# Altium schematic sheet power_amplifier.SchDoc
size A4
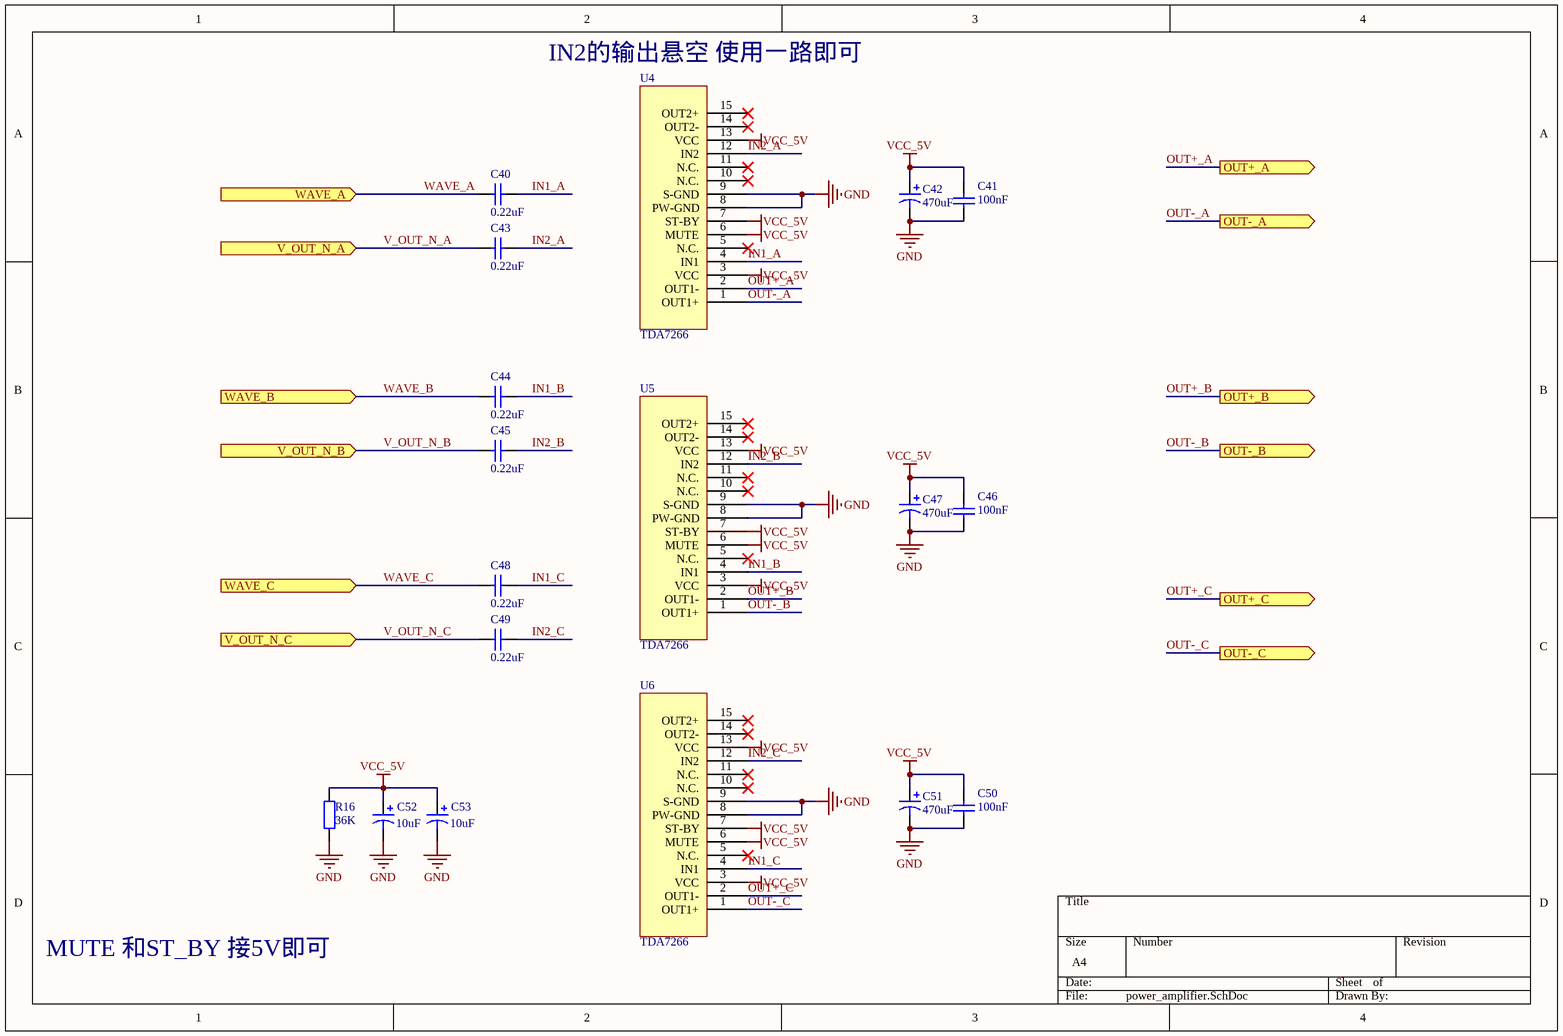
[diagram p0: power_amplifier.SchDoc]

## Parts
C40  value 0.22uF  [0805]  (hidden comment: Cap)
C41  value 100nF  [0805]  (hidden comment: Cap)
C42  value 470uF  [cap贴片铝电解质470uF 16V]  (hidden comment: Cap Poll)
C43  value 0.22uF  [0805]  (hidden comment: Cap)
C44  value 0.22uF  [0805]  (hidden comment: Cap)
C45  value 0.22uF  [0805]  (hidden comment: Cap)
C46  value 100nF  [0805]  (hidden comment: Cap)
C47  value 470uF  [cap贴片铝电解质470uF 16V]  (hidden comment: Cap Poll)
C48  value 0.22uF  [0805]  (hidden comment: Cap)
C49  value 0.22uF  [0805]  (hidden comment: Cap)
C50  value 100nF  [0805]  (hidden comment: Cap)
C51  value 470uF  [cap贴片铝电解质470uF 16V]  (hidden comment: Cap Poll)
C52  value 10uF  [Cap 3528B]  (hidden comment: Cap Poll)
C53  value 10uF  [Cap 3528B]  (hidden comment: Cap Poll)
R16  value 36K  [0805]  (hidden comment: Res)
U4  TDA7266  [TDA7266]
U5  TDA7266  [TDA7266]
U6  TDA7266  [TDA7266]

## Ports
OUT+_A (out), OUT+_B (out), OUT+_C (out), OUT-_A (out), OUT-_B (out), OUT-_C (out), V_OUT_N_A (in), V_OUT_N_B (in), V_OUT_N_C (in), WAVE_A (in), WAVE_B (in), WAVE_C (in)

## Nets
GND: C41.1 C42.2 C46.1 C47.2 C50.1 C51.2 C52.2 C53.2 R16.1 U4.8(PW-GND) U4.9(S-GND) U5.8(PW-GND) U5.9(S-GND) U6.8(PW-GND) U6.9(S-GND)
VCC_5V: C41.2 C42.1 C46.2 C47.1 C50.2 C51.1 C52.1 C53.1 R16.2 U4.3(VCC) U4.6(MUTE) U4.7(ST-BY) U4.13(VCC) U5.3(VCC) U5.6(MUTE) U5.7(ST-BY) U5.13(VCC) U6.3(VCC) U6.6(MUTE) U6.7(ST-BY) U6.13(VCC)
IN1_A: C40.2 U4.4(IN1)
IN1_B: C44.2 U5.4(IN1)
IN1_C: C48.2 U6.4(IN1)
IN2_A: C43.2 U4.12(IN2)
IN2_B: C45.2 U5.12(IN2)
IN2_C: C49.2 U6.12(IN2)
OUT+_A: U4.2(OUT1-) ; port OUT+_A
OUT+_B: U5.2(OUT1-) ; port OUT+_B
OUT+_C: U6.2(OUT1-) ; port OUT+_C
OUT-_A: U4.1(OUT1+) ; port OUT-_A
OUT-_B: U5.1(OUT1+) ; port OUT-_B
OUT-_C: U6.1(OUT1+) ; port OUT-_C
V_OUT_N_A: C43.1 ; port V_OUT_N_A
V_OUT_N_B: C45.1 ; port V_OUT_N_B
V_OUT_N_C: C49.1 ; port V_OUT_N_C
WAVE_A: C40.1 ; port WAVE_A
WAVE_B: C44.1 ; port WAVE_B
WAVE_C: C48.1 ; port WAVE_C

Not connected (* = marked no-connect by the designer): U4 5(N.C.)* 10(N.C.)* 11(N.C.)* 14(OUT2-)* 15(OUT2+)*; U5 5(N.C.)* 10(N.C.)* 11(N.C.)* 14(OUT2-)* 15(OUT2+)*; U6 5(N.C.)* 10(N.C.)* 11(N.C.)* 14(OUT2-)* 15(OUT2+)*

## Notes on the sheet
- (near U4) IN2的输出悬空 使用一路即可
- MUTE 和ST_BY 接5V即可

## Library data of the parts
C40 C41 C43-C46 C48-C50 = Cap: 原理图绘制者: 刘永钦; 原理图何处使用过: 2014年飞思卡尔底板; 原理图审核人1: 徐鹏飞; 封装0805何处使用: 2015年航行器遥控器; 原理图审核人2: 朱觉文; 封装0603何处使用过: 在2401转接板上使用; Pressure Voltage: 16V; 原理图提供者: 刘永钦; 封装0805绘制者: 刘永钦; 封装0805提供者: 刘永钦; 封装0805审核人1: 徐鹏飞; 封装0805审核人2: 朱觉文; 封装0603绘制者: 刘永钦; 封装0603提供者: 刘永钦; 封装0603审核人1: 朱觉文; 封装0603审核人2: 徐鹏飞
C42 C47 C51-C53 = Cap Poll: 原理图绘制者: 刘永钦; 原理图何处使用过: 2014年飞思卡尔底板; 原理图审核人1: 徐鹏飞; 封装CAP 钽 7343 E何处使用: 2014年飞思卡尔驱动板; 封装cap贴片铝电解质470uF 16V绘制者: 李泽; 封装cap贴片铝电解质470uF 16V何处使用: 2015年飞思卡尔主板; 封装Cap 3528B绘制者: 陈汉诚; 封装Cap 3528B使用过: 2015年飞思卡尔驱动板; 封装Cap直插 10uF 50V: 10级718学长; 封装Cap直插 10uF 50V使用过: 2012年XS128学习板的主板; 封装Cap 3528B审核人2: 朱觉文; 原理图提供者: 刘永钦; 封装CAP 钽 7343 E绘制者: 刘永钦; 封装CAP 钽 7343 E提供者: 刘永钦; 封装CAP 钽 7343 E审核人1: 徐鹏飞; 封装cap贴片铝电解质470uF 16V提供者: 刘永钦; 封装cap贴片铝电解质470uF 16V审核人1: 徐鹏飞; 封装Cap 3528B提供者: 刘永钦; 封装Cap 3528B审核人1: 徐鹏飞; 封装Cap直插 10uF 50V提供者: 刘永钦; 封装Cap直插 10uF 50V审核人1: 徐鹏飞; 封装Cap直插 10uF 50V审核人2: 朱觉文; 封装cap贴片铝电解质470uF 16V审核人2: 朱觉文; 封装CAP 钽 7343 E审核人2: 朱觉文; 原理图审核人2: 朱觉文
R16 = Res: 原理图绘制者: 刘永钦; 原理图何处使用过: 2014年飞思卡尔底板; 原理图审核人1: 徐鹏飞; 封装0805何处使用过: 2015年航行器遥控器; 原理图审核人2: 朱觉文; 封装2512-RESC6332X06N何处使用过: 在无刷直流电机驱动板上使用过; 封装0603何处使用过: 在2401转接板上使用; 原理图提供者: 刘永钦; 封装0805绘制者: 刘永钦; 封装0805提供者: 刘永钦; 封装0805审核人1: 徐鹏飞; 封装0805审核人2: 朱觉文; 封装0603提供者: 刘永钦; 封装0603审核人2: 朱觉文; 封装0603审核人1: 徐鹏飞; 封装2512-RESC6332X06N审核人2: 朱觉文; 封装2512-RESC6332X06N提供者: 刘永钦; 封装2512-RESC6332X06N审核人1: 徐鹏飞; 封装0603绘制者: 刘永钦; 封装2512-RESC6332X06N绘制者: 刘永钦